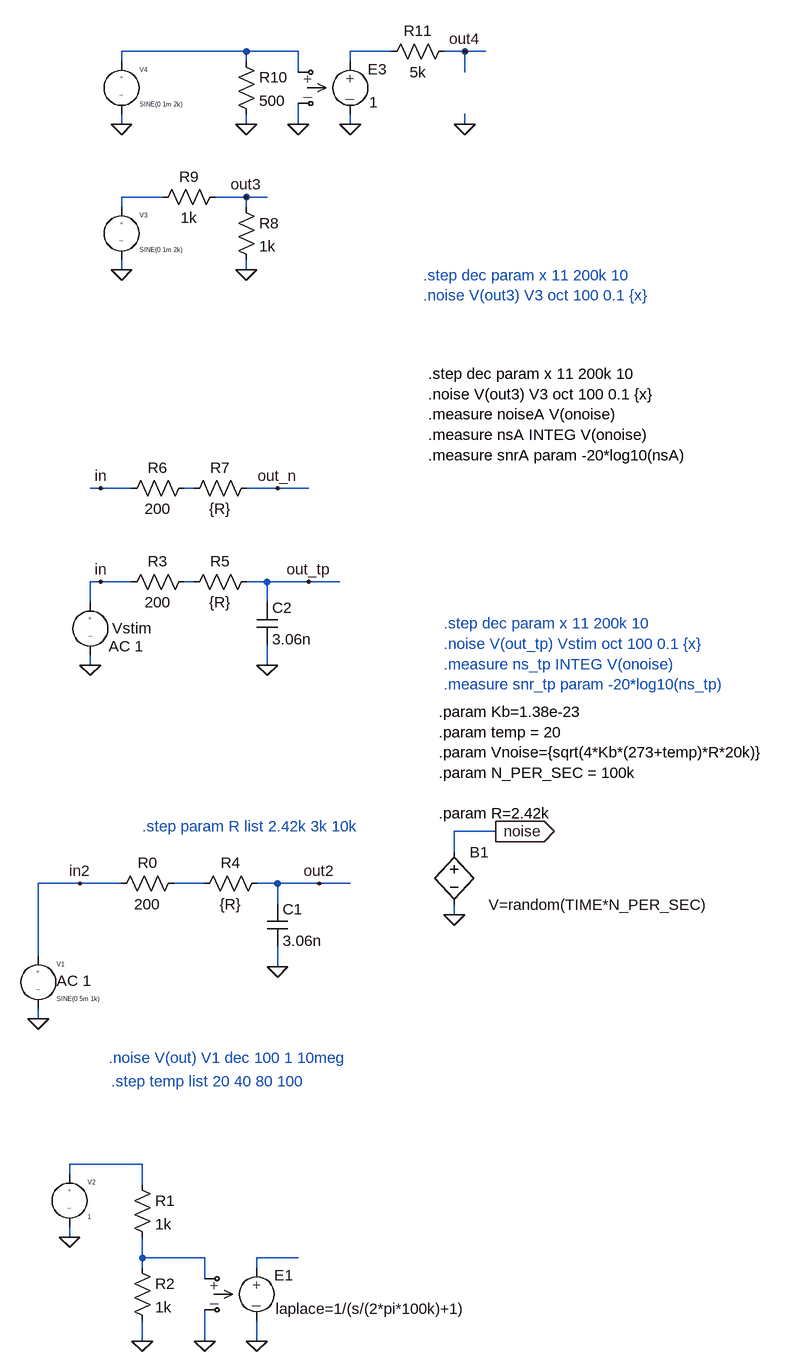
[diagram p0: schematic thermal_whitenoise.asc]
thermal_whitenoise.asc, the LTspice schematic file:
Version 4
SHEET 1 1868 680
WIRE 448 -1712 256 -1712
WIRE 528 -1712 448 -1712
WIRE 672 -1712 608 -1712
WIRE 784 -1712 752 -1712
WIRE 816 -1712 784 -1712
WIRE 256 -1696 256 -1712
WIRE 448 -1696 448 -1712
WIRE 608 -1696 608 -1712
WIRE 528 -1680 528 -1712
WIRE 784 -1680 784 -1712
WIRE 256 -1600 256 -1616
WIRE 448 -1600 448 -1616
WIRE 528 -1600 528 -1632
WIRE 608 -1600 608 -1616
WIRE 784 -1600 784 -1616
WIRE 320 -1488 256 -1488
WIRE 448 -1488 400 -1488
WIRE 480 -1488 448 -1488
WIRE 256 -1472 256 -1488
WIRE 448 -1472 448 -1488
WIRE 256 -1376 256 -1392
WIRE 448 -1376 448 -1392
WIRE 224 -1040 208 -1040
WIRE 272 -1040 224 -1040
WIRE 368 -1040 352 -1040
WIRE 496 -1040 448 -1040
WIRE 544 -1040 496 -1040
WIRE 224 -896 208 -896
WIRE 272 -896 224 -896
WIRE 368 -896 352 -896
WIRE 480 -896 448 -896
WIRE 544 -896 480 -896
WIRE 592 -896 544 -896
WIRE 208 -864 208 -896
WIRE 480 -864 480 -896
WIRE 208 -768 208 -784
WIRE 480 -768 480 -800
WIRE 832 -512 768 -512
WIRE 768 -480 768 -512
WIRE 192 -432 128 -432
WIRE 256 -432 192 -432
WIRE 384 -432 336 -432
WIRE 496 -432 464 -432
WIRE 560 -432 496 -432
WIRE 608 -432 560 -432
WIRE 496 -400 496 -432
WIRE 768 -384 768 -400
WIRE 128 -320 128 -432
WIRE 496 -304 496 -336
WIRE 128 -224 128 -240
WIRE 288 0 176 0
WIRE 176 16 176 0
WIRE 288 32 288 0
WIRE 176 112 176 96
WIRE 288 144 288 112
WIRE 384 144 288 144
WIRE 528 144 464 144
WIRE 288 160 288 144
WIRE 464 160 464 144
WIRE 384 176 384 144
WIRE 288 272 288 240
WIRE 384 272 384 224
WIRE 464 272 464 240
FLAG 288 272 0
FLAG 176 112 0
FLAG 560 -432 out2
FLAG 464 272 0
FLAG 384 272 0
FLAG 128 -224 0
FLAG 496 -304 0
FLAG 192 -432 in2
FLAG 544 -896 out_tp
FLAG 208 -768 0
FLAG 480 -768 0
FLAG 224 -896 in
FLAG 768 -384 0
FLAG 832 -512 noise
IOPIN 832 -512 Out
FLAG 224 -1040 in
FLAG 496 -1040 out_n
FLAG 256 -1376 0
FLAG 448 -1376 0
FLAG 448 -1488 out3
FLAG 608 -1600 0
FLAG 528 -1600 0
FLAG 256 -1600 0
FLAG 448 -1600 0
FLAG 784 -1600 0
FLAG 784 -1712 out4
SYMBOL source-V 176 0 R0
WINDOW 123 0 0 Left 2
WINDOW 39 0 0 Left 2
SYMATTR InstName V2
SYMATTR Value 1
SYMBOL res 272 16 R0
SYMATTR InstName R1
SYMATTR Value 1k
SYMBOL res 272 144 R0
SYMATTR InstName R2
SYMATTR Value 1k
SYMBOL crtl-V-V 464 144 R0
SYMATTR InstName E1
SYMATTR Value laplace=1/(s/(2*pi*100k)+1)
SYMBOL source-V 128 -336 R0
WINDOW 123 28 54 Left 2
WINDOW 39 0 0 Left 2
SYMATTR InstName V1
SYMATTR Value SINE(0 5m 1k)
SYMATTR Value2 AC 1
SYMBOL res 240 -416 R270
WINDOW 0 32 56 VTop 2
WINDOW 3 0 56 VBottom 2
SYMATTR InstName R0
SYMATTR Value 200
SYMBOL res 368 -416 R270
WINDOW 0 32 56 VTop 2
WINDOW 3 0 56 VBottom 2
SYMATTR InstName R4
SYMATTR Value {R}
SYMBOL cap 480 -400 R0
SYMATTR InstName C1
SYMATTR Value 3.06n
SYMBOL res 256 -880 R270
WINDOW 0 32 56 VTop 2
WINDOW 3 0 56 VBottom 2
SYMATTR InstName R3
SYMATTR Value 200
SYMBOL res 352 -880 R270
WINDOW 0 32 56 VTop 2
WINDOW 3 0 56 VBottom 2
SYMATTR InstName R5
SYMATTR Value {R}
SYMBOL cap 464 -864 R0
SYMATTR InstName C2
SYMATTR Value 3.06n
SYMBOL source-V 208 -880 R0
WINDOW 0 34 55 Left 2
WINDOW 123 28 83 Left 2
WINDOW 39 0 0 Left 2
SYMATTR InstName Vstim
SYMATTR Value ""
SYMATTR Value2 AC 1
SYMBOL bv 768 -496 R0
WINDOW 3 53 97 Left 2
SYMATTR Value V=random(TIME*N_PER_SEC)
SYMATTR InstName B1
SYMBOL res 256 -1024 R270
WINDOW 0 32 56 VTop 2
WINDOW 3 0 56 VBottom 2
SYMATTR InstName R6
SYMATTR Value 200
SYMBOL res 352 -1024 R270
WINDOW 0 32 56 VTop 2
WINDOW 3 0 56 VBottom 2
SYMATTR InstName R7
SYMATTR Value {R}
SYMBOL source-V 256 -1488 R0
WINDOW 123 0 0 Left 2
WINDOW 39 0 0 Left 2
SYMATTR InstName V3
SYMATTR Value SINE(0 1m 2k)
SYMBOL res 432 -1488 R0
SYMATTR InstName R8
SYMATTR Value 1k
SYMBOL crtl-V-V 608 -1712 R0
SYMATTR InstName E3
SYMATTR Value 1
SYMBOL source-V 256 -1712 R0
WINDOW 123 0 0 Left 2
WINDOW 39 0 0 Left 2
SYMATTR InstName V4
SYMATTR Value SINE(0 1m 2k)
SYMBOL res 432 -1712 R0
SYMATTR InstName R10
SYMATTR Value 500
SYMBOL res 656 -1696 R270
WINDOW 0 32 56 VTop 2
WINDOW 3 0 56 VBottom 2
SYMATTR InstName R11
SYMATTR Value 5k
SYMBOL res 416 -1504 R90
WINDOW 0 0 56 VBottom 2
WINDOW 3 32 56 VTop 2
SYMATTR InstName R9
SYMATTR Value 1k
TEXT 236 -164 Left 2 ;.noise V(out) V1 dec 100 1 10meg
TEXT 240 -128 Left 2 ;.step temp list 20 40 80 100
TEXT 288 -520 Left 2 ;.step param R list 2.42k 3k 10k
TEXT 744 -696 Left 2 !.param Kb=1.38e-23\n.param temp = 20\n.param Vnoise={sqrt(4*Kb*(273+temp)*R*20k)}\n.param N_PER_SEC = 100k\n \n.param R=2.42k
TEXT 752 -832 Left 2 ;.step dec param x 11 200k 10\n.noise V(out_tp) Vstim oct 100 0.1 {x}\n.measure ns_tp INTEG V(onoise)\n.measure snr_tp param -20*log10(ns_tp)
TEXT 728 -1216 Left 2 !.step dec param x 11 200k 10\n.noise V(out3) V3 oct 100 0.1 {x}\n.measure noiseA V(onoise)\n.measure nsA INTEG V(onoise)\n.measure snrA param -20*log10(nsA)
TEXT 720 -1368 Left 2 ;.step dec param x 11 200k 10\n.noise V(out3) V3 oct 100 0.1 {x}

The netlist it stands for:
* thermal_whitenoise.asc
V2 N007 0 1
R1 N007 N008 1k
R2 N008 0 1k
E1 N009 0 N008 0 laplace=1/(s/(2*pi*100k)+1)
V1 in2 0 SINE(0 5m 1k) AC 1
R0 in2 N006 200
R4 N006 out2 {R}
C1 out2 0 3.06n
R3 in N005 200
R5 N005 out_tp {R}
C2 out_tp 0 3.06n
Vstim in 0 AC 1
B1 noise 0 V=random(TIME*N_PER_SEC)
R6 in N004 200
R7 N004 out_n {R}
V3 N003 0 SINE(0 1m 2k)
R8 out3 0 1k
E3 N002 0 N001 0 1
V4 N001 0 SINE(0 1m 2k)
R10 N001 0 500
R11 N002 out4 5k
R9 out3 N003 1k
* .noise V(out) V1 dec 100 1 10meg
* .step temp list 20 40 80 100
* .step param R list 2.42k 3k 10k
.param Kb=1.38e-23
.param temp = 20
.param Vnoise={sqrt(4*Kb*(273+temp)*R*20k)}
.param N_PER_SEC = 100k
.param R=2.42k
* .step dec param x 11 200k 10
* .noise V(out_tp) Vstim oct 100 0.1 {x}
* .measure ns_tp INTEG V(onoise)
* .measure snr_tp param -20*log10(ns_tp)
.step dec param x 11 200k 10
.noise V(out3) V3 oct 100 0.1 {x}
.measure noiseA V(onoise)
.measure nsA INTEG V(onoise)
.measure snrA param -20*log10(nsA)
* .step dec param x 11 200k 10
* .noise V(out3) V3 oct 100 0.1 {x}
.backanno
.end